# EAGLE schematic open-bldc (EAGLE 6.2)
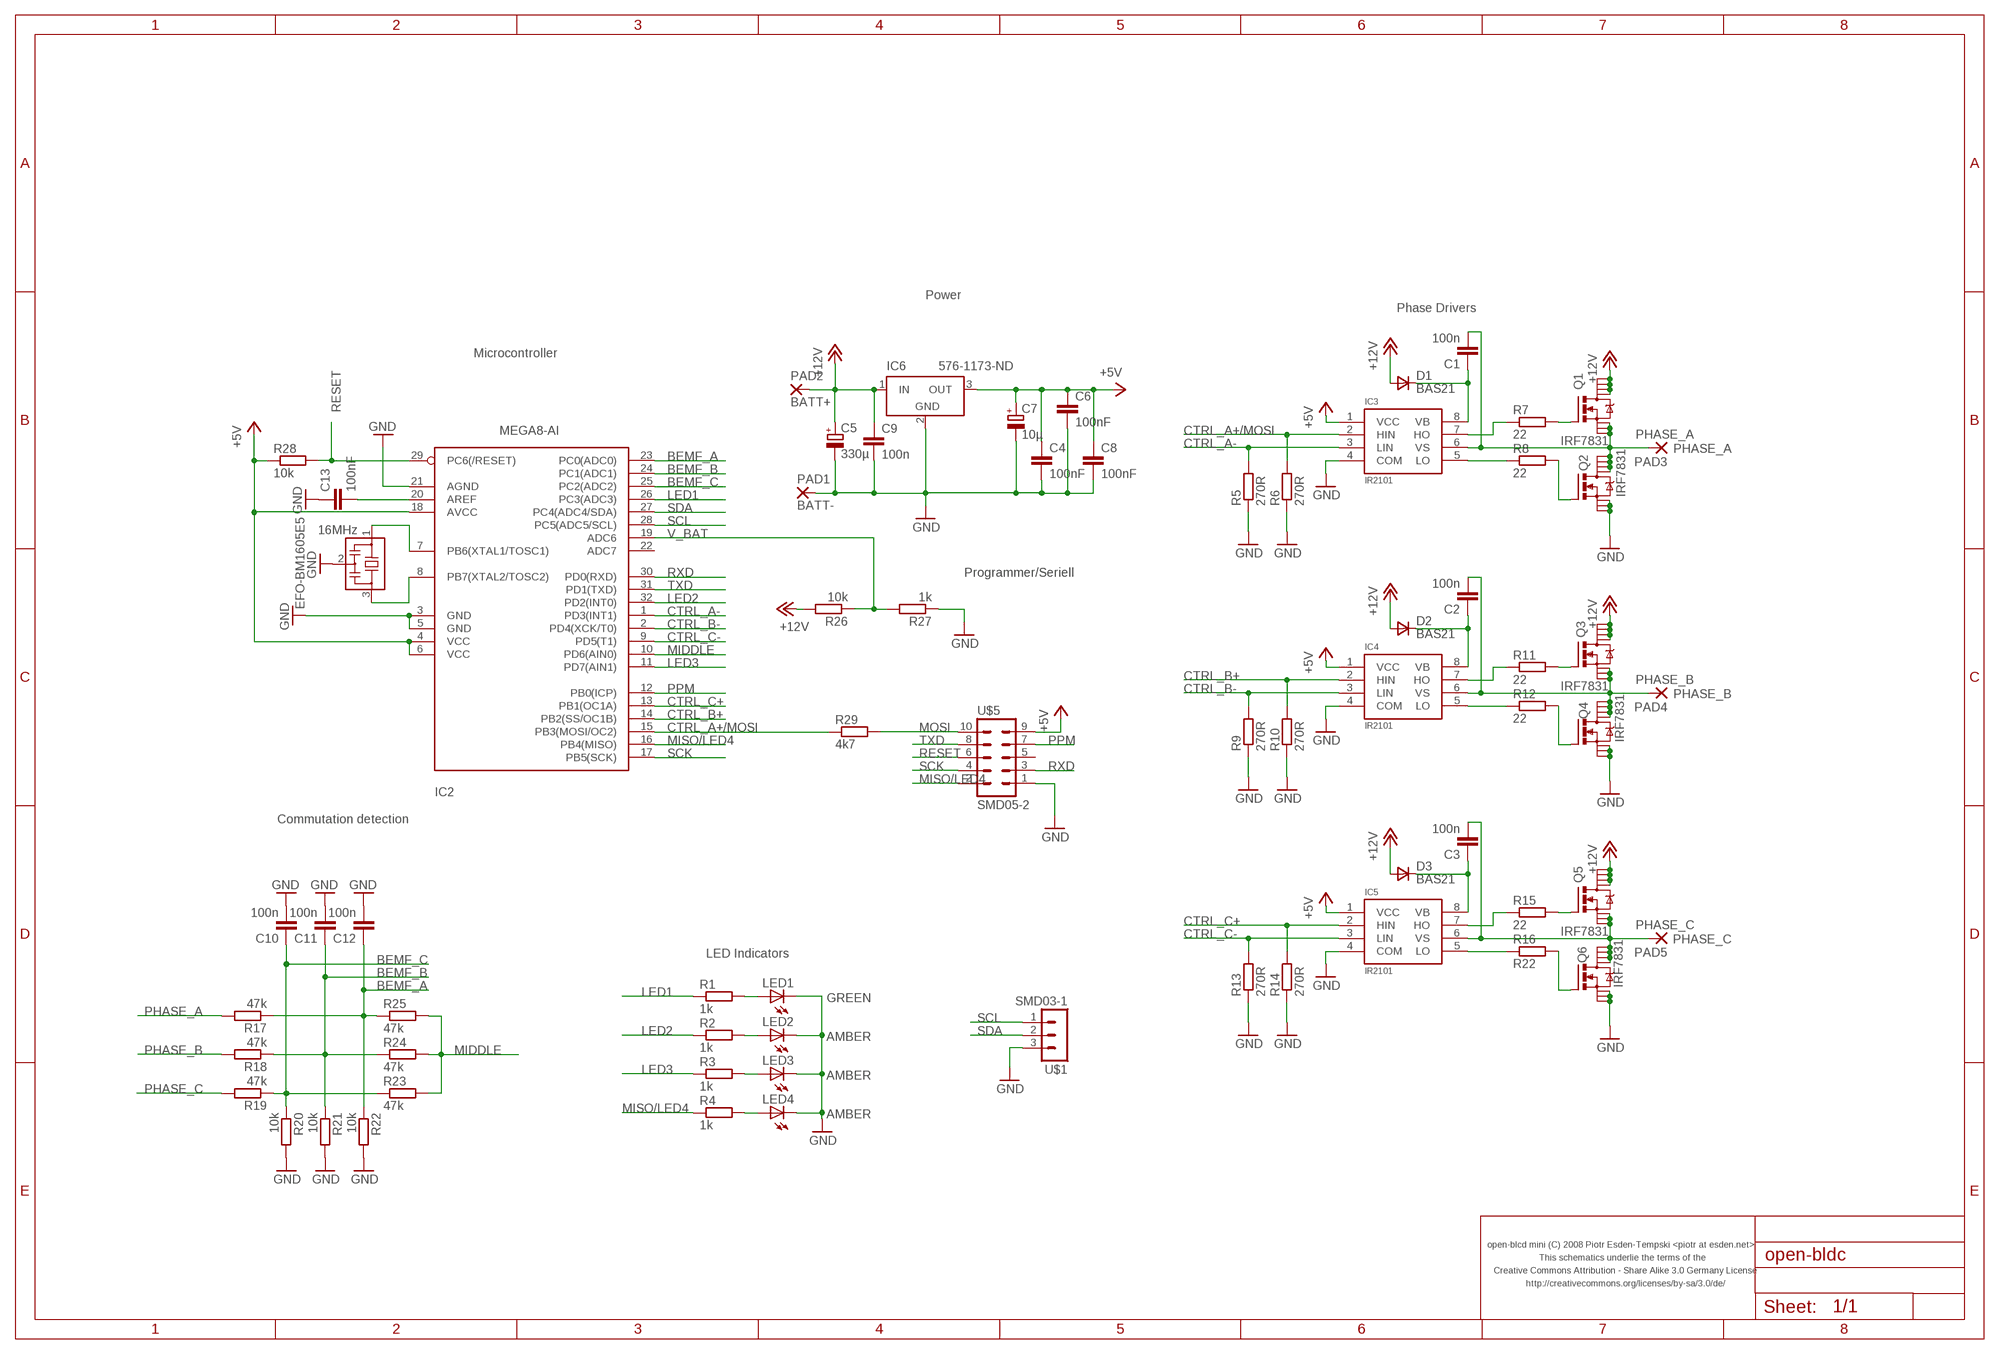
[diagram p0: schematic, sheet 1]

## Parts
C1  100n  C-EUC0603  [C0603]
C2  100n  C-EUC0603  [C0603]
C3  100n  C-EUC0603  [C0603]
C4  100nF  C-EUC0603  [C0603]
C5  330µ  CPOL-EUE3.5-8  [E3,5-8]
C6  100nF  C-EUC0603  [C0603]
C7  10µ  CPOL-EUD/7343-31R  [D/7343-31R]
C8  100nF  C-EUC0603  [C0603]
C9  100n  C-EUC0603  [C0603]
C10  100n  C-EUC0603  [C0603]
C11  100n  C-EUC0603  [C0603]
C12  100n  C-EUC0603  [C0603]
C13  100nF  C-EUC0603  [C0603]
D1  BAS21  VAR2SOT23  [SOT-23]
D2  BAS21  VAR2SOT23  [SOT-23]
D3  BAS21  VAR2SOT23  [SOT-23]
EFO-BM1605E5  16MHz  EFOBM  [EFOBM]
IC2  MEGA8-AI  [TQFP32-08]
IC3  IR2101  [SO-8]
IC4  IR2101  [SO-8]
IC5  IR2101  [SO-8]
IC6  576-1173-ND  LT1129CST5  [SOT223]
LED1  GREEN  LEDCHIP-LED0603  [CHIP-LED0603]
LED2  AMBER  LEDCHIP-LED0603  [CHIP-LED0603]
LED3  AMBER  LEDCHIP-LED0603  [CHIP-LED0603]
LED4  AMBER  LEDCHIP-LED0603  [CHIP-LED0603]
PAD1  BATT-  SMD5  [SMD2,54-5,08]
PAD2  BATT+  SMD5  [SMD2,54-5,08]
PAD3  PHASE_A  SMD5  [SMD2,54-5,08]
PAD4  PHASE_B  SMD5  [SMD2,54-5,08]
PAD5  PHASE_C  SMD5  [SMD2,54-5,08]
Q1  IRF7831  N-MOSFET-SO8S  [SO-08]
Q2  IRF7831  N-MOSFET-SO8S  [SO-08]
Q3  IRF7831  N-MOSFET-SO8S  [SO-08]
Q4  IRF7831  N-MOSFET-SO8S  [SO-08]
Q5  IRF7831  N-MOSFET-SO8S  [SO-08]
Q6  IRF7831  N-MOSFET-SO8S  [SO-08]
R1  1k  R-EU_R0603  [R0603]
R2  1k  R-EU_R0603  [R0603]
R3  1k  R-EU_R0603  [R0603]
R4  1k  R-EU_R0603  [R0603]
R5  270R  R-EU_R0603  [R0603]
R6  270R  R-EU_R0603  [R0603]
R7  22  R-EU_R0603  [R0603]
R8  22  R-EU_R0603  [R0603]
R9  270R  R-EU_R0603  [R0603]
R10  270R  R-EU_R0603  [R0603]
R11  22  R-EU_R0603  [R0603]
R12  22  R-EU_R0603  [R0603]
R13  270R  R-EU_R0603  [R0603]
R14  270R  R-EU_R0603  [R0603]
R15  22  R-EU_R0603  [R0603]
R16  R22  R-EU_R0603  [R0603]
R17  47k  R-EU_R0603  [R0603]
R18  47k  R-EU_R0603  [R0603]
R19  47k  R-EU_R0603  [R0603]
R20  10k  R-EU_R0603  [R0603]
R21  10k  R-EU_R0603  [R0603]
R22  10k  R-EU_R0603  [R0603]
R23  47k  R-EU_R0603  [R0603]
R24  47k  R-EU_R0603  [R0603]
R25  47k  R-EU_R0603  [R0603]
R26  10k  R-EU_R0603  [R0603]
R27  1k  R-EU_R0603  [R0603]
R28  10k  R-EU_R0603  [R0603]
R29  4k7  R-EU_R0603  [R0603]
U$1  SMD03-1  [SMD03-1]
U$5  SMD05-2  [SMD05-2]

## Nets
+5V: C4.1 C6.1 C7.+ C8.1 IC2.4(VCC) IC2.6(VCC) IC2.18(AVCC) IC3.1(VCC) IC4.1(VCC) IC5.1(VCC) IC6.3(OUT) R28.1 U$5.9
+12V: C5.+ C9.1 D1.3(A) D2.3(A) D3.3(A) IC6.1(IN) PAD2.1(P) Q1.5(D) Q1.6(D) Q1.7(D) Q1.8(D) Q3.5(D) Q3.6(D) Q3.7(D) Q3.8(D) Q5.5(D) Q5.6(D) Q5.7(D) Q5.8(D) R26.2
BEMF_A: C12.1 IC2.23(PC0(ADC0)) R17.1 R22.1 R25.1
BEMF_B: C11.1 IC2.24(PC1(ADC1)) R18.1 R21.1 R24.1
BEMF_C: C10.1 IC2.25(PC2(ADC2)) R19.1 R20.1 R23.1
CTRL_A+/MOSI: IC2.15(PB3(MOSI/OC2)) IC3.2(HIN) R6.2 R29.1
CTRL_A-: IC2.1(PD3(INT1)) IC3.3(LIN) R5.2
CTRL_B+: IC2.14(PB2(SS/OC1B)) IC4.2(HIN) R10.2
CTRL_B-: IC2.2(PD4(XCK/T0)) IC4.3(LIN) R9.2
CTRL_C+: IC2.13(PB1(OC1A)) IC5.2(HIN) R14.2
CTRL_C-: IC2.9(PD5(T1)) IC5.3(LIN) R13.2
GND: C4.2 C5.- C6.2 C7.- C8.2 C9.2 C10.2 C11.2 C12.2 C13.1 EFO-BM1605E5.2 IC2.3(GND) IC2.5(GND) IC2.21(AGND) IC3.4(COM) IC4.4(COM) IC5.4(COM) IC6.2(GND) LED1.C LED2.C LED3.C LED4.C PAD1.1(P) Q2.1(S) Q2.2(S) Q2.3(S) Q4.1(S) Q4.2(S) Q4.3(S) Q6.1(S) Q6.2(S) Q6.3(S) R5.1 R6.1 R9.1 R10.1 R13.1 R14.1 R20.2 R21.2 R22.2 R27.1 U$1.3 U$5.1
LED1: IC2.26(PC3(ADC3)) R1.1
LED2: IC2.32(PD2(INT0)) R2.1
LED3: IC2.11(PD7(AIN1)) R3.1
MIDDLE: IC2.10(PD6(AIN0)) R23.2 R24.2 R25.2
MISO/LED4: IC2.16(PB4(MISO)) R4.1 U$5.2
MOSI: R29.2 U$5.10
N$1: IC4.7(HO) R11.1
N$2: IC3.7(HO) R7.1
N$3: LED1.A R1.2
N$4: LED2.A R2.2
N$5: LED3.A R3.2
N$6: C13.2 IC2.20(AREF)
N$7: IC3.5(LO) R8.1
N$8: EFO-BM1605E5.1 IC2.7(PB6(XTAL1/TOSC1))
N$9: EFO-BM1605E5.3 IC2.8(PB7(XTAL2/TOSC2))
N$10: LED4.A R4.2
N$11: Q3.4(G) R11.2
N$12: C1.1 D1.1(C) IC3.8(VB)
N$13: IC4.5(LO) R12.1
N$15: Q2.4(G) R8.2
N$16: C2.1 D2.1(C) IC4.8(VB)
N$17: Q4.4(G) R12.2
N$18: IC5.7(HO) R15.1
N$19: IC5.5(LO) R16.1
N$20: Q5.4(G) R15.2
N$21: C3.1 D3.1(C) IC5.8(VB)
N$22: Q6.4(G) R16.2
N$23: Q1.4(G) R7.2
PHASE_A: C1.2 IC3.6(VS) PAD3.1(P) Q1.1(S) Q1.2(S) Q1.3(S) Q2.5(D) Q2.6(D) Q2.7(D) Q2.8(D) R17.2
PHASE_B: C2.2 IC4.6(VS) PAD4.1(P) Q3.1(S) Q3.2(S) Q3.3(S) Q4.5(D) Q4.6(D) Q4.7(D) Q4.8(D) R18.2
PHASE_C: C3.2 IC5.6(VS) PAD5.1(P) Q5.1(S) Q5.2(S) Q5.3(S) Q6.5(D) Q6.6(D) Q6.7(D) Q6.8(D) R19.2
PPM: IC2.12(PB0(ICP)) U$5.7
RESET: IC2.29(PC6(/RESET)) R28.2 U$5.6
RXD: IC2.30(PD0(RXD)) U$5.3
SCK: IC2.17(PB5(SCK)) U$5.4
SCL: IC2.28(PC5(ADC5/SCL)) U$1.1
SDA: IC2.27(PC4(ADC4/SDA)) U$1.2
TXD: IC2.31(PD1(TXD)) U$5.8
V_BAT: IC2.19(ADC6) R26.1 R27.2
Unconnected: IC2.22(ADC7) U$5.5

## Notes on the sheet
- Power
- Phase Drivers
- Microcontroller
- Programmer/Seriell
- Commutation detection
- LED Indicators
- open-blcd mini (C) 2008 Piotr Esden-Tempski <piotr at esden.net>
- This schematics underlie the terms of the
- Creative Commons Attribution - Share Alike 3.0 Germany License
- http://creativecommons.org/licenses/by-sa/3.0/de/

## Power pins joined to a net without a drawn wire
GND: IC6.4(GND)

## Library data of the parts
C1-C4 C6 C8-C13 = rcl:C-EU: CAPACITOR, European symbol
C5 C7 = rcl:CPOL-EU: POLARIZED CAPACITOR, European symbol
D1-D3 = zetex:VAR2SOT23: DIODE
EFO-BM1605E5 = open-bldc:EFOBM
IC2 = atmel:MEGA8: MICROCONTROLLER 8 Kbytes FLASH, 1 kbytes SRAM, 512 bytes EEPROM, USART, 6-channel 10 bit ADC, 2-channel 8 bit ADC Pin compatible with Atmega48, ATMega88, ATMega168 Source: avr.lbr
IC3-IC5 = open-bldc:IR2101
IC6 = linear-technology:LT1129CST5: VOLTAGE REGULATOR with shutdown
LED1-LED4 = led:LED: LED OSRAM: - CHIPLED LG R971, LG N971, LY N971, LG Q971, LY Q971, LO R971, LY R971 LH N974, LH R974 LS Q976, LO Q976, LY Q976 LO Q996 - Hyper CHIPLED LW Q18S LB Q993, LB Q99A, LB R99A - SideLED LS A670, LO A670, LY A670, LG A670, LP A670 LB A673, LV A673, LT A673, LW A673 LH A674 LY A675 LS A676, LA A676, LO A676, LY A676, LW A676 LS A679, LY A679, LG A679 - Hyper Micro SIDELED® LS Y876, LA Y876, LO Y876, LY Y876 LT Y87S - SmartLED LW L88C, LW L88S LB L89C, LB L89S, LG L890 LS L89K, LO L89K, LY L89K LS L896, LA L896, LO L896, LY L896 - TOPLED LS T670, LO T670, LY T670, LG T670, LP T670 LSG T670, LSP T670, LSY T670, LOP T670, LYG T670 LG T671, LOG T671, LSG T671 LB T673, LV T673, LT T673, LW T673 LH T674 LS T676, LA T676, LO T676, LY T676, LB T676, LH T676, LSB T676, LW T676 LB T67C, LV T67C, LT T67C, LS T67K, LO T67K, LY T67K, LW E67C LS E67B, LA E67B, LO E67B, LY E67B, LB E67C, LV E67C, LT E67C LW T67C LS T679, LY T679, LG T679 LS T770, LO T770, LY T770, LG T770, LP T770 LB T773, LV T773, LT T773, LW T773 LH T774 LS E675, LA E675, LY E675, LS T675 LS T776, LA T776, LO T776, LY T776, LB T776 LHGB T686 LT T68C, LB T68C - Hyper Mini TOPLED® LB M676 - Mini TOPLED Santana® LG M470 LS M47K, LO M47K, LY M47K Source: http://www.osram.convergy.de LUXEON: - LUMILED® LXK2-PW12-R00, LXK2-PW12-S00, LXK2-PW14-U00, LXK2-PW14-V00 LXK2-PM12-R00, LXK2-PM12-S00, LXK2-PM14-U00 LXK2-PE12-Q00, LXK2-PE12-R00, LXK2-PE12-S00, LXK2-PE14-T00, LXK2-PE14-U00 LXK2-PB12-K00, LXK2-PB12-L00, LXK2-PB12-M00, LXK2-PB14-N00, LXK2-PB14-P00, LXK2-PB14-Q00 LXK2-PR12-L00, LXK2-PR12-M00, LXK2-PR14-Q00, LXK2-PR14-R00 LXK2-PD12-Q00, LXK2-PD12-R00, LXK2-PD12-S00 LXK2-PH12-R00, LXK2-PH12-S00 LXK2-PL12-P00, LXK2-PL12-Q00, LXK2-PL12-R00 Source: www.luxeon.com KINGBRIGHT: KA-3528ASYC Source: www.kingbright.com
PAD1-PAD5 = wirepad:SMD5: SMD PAD
Q1-Q6 = my-transistor-power:N-MOSFET-SO8: N-Channel MOSFET Example: FDS7760A; N-Channel Logic Level PowerTrench® MOSFET FDS2572; N-Channel UltraFET® Trench MOSFET Source: www.fairchildsemi.com
R1-R29 = rcl:R-EU_: RESISTOR, European symbol
U$1 = patrick:SMD03-1
U$5 = patrick:SMD05-2

## Net classes
0 default: width 0.152 mm, drill 0.305 mm, clearance 0.152 mm